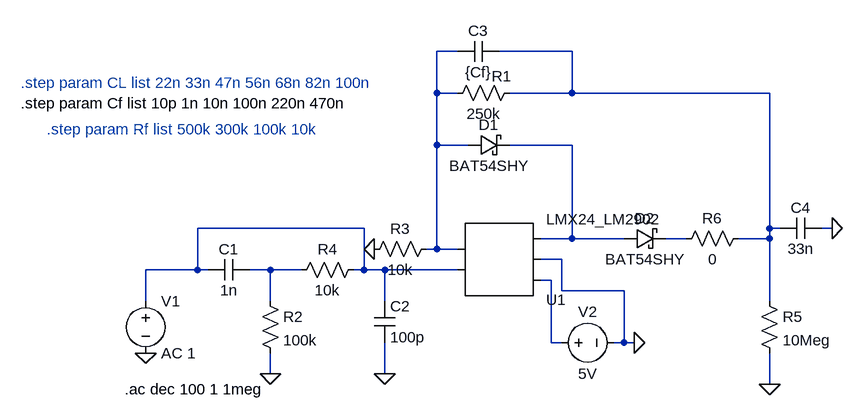
[diagram p0: schematic Opamp-AC2.asc]
Opamp-AC2.asc, the LTspice schematic file:
Version 4
SHEET 1 1220 680
WIRE 624 -256 592 -256
WIRE 800 -256 688 -256
WIRE 592 -192 592 -256
WIRE 624 -192 592 -192
WIRE 800 -192 800 -256
WIRE 800 -192 704 -192
WIRE 1104 -192 800 -192
WIRE 592 -112 592 -192
WIRE 640 -112 592 -112
WIRE 800 -112 704 -112
WIRE 480 16 224 16
WIRE 1104 16 1104 -192
WIRE 1120 16 1104 16
WIRE 1200 16 1184 16
WIRE 800 32 800 -112
WIRE 800 32 752 32
WIRE 880 32 800 32
WIRE 976 32 944 32
WIRE 1104 32 1104 16
WIRE 1104 32 1056 32
WIRE 592 48 592 -112
WIRE 592 48 576 48
WIRE 624 48 592 48
WIRE 784 64 752 64
WIRE 224 80 224 16
WIRE 224 80 144 80
WIRE 240 80 224 80
WIRE 336 80 304 80
WIRE 384 80 336 80
WIRE 480 80 480 16
WIRE 480 80 464 80
WIRE 512 80 480 80
WIRE 624 80 512 80
WIRE 768 96 752 96
WIRE 784 112 784 64
WIRE 880 112 784 112
WIRE 144 128 144 80
WIRE 336 128 336 80
WIRE 512 128 512 80
WIRE 1104 128 1104 32
WIRE 768 192 768 96
WIRE 784 192 768 192
WIRE 880 192 880 112
WIRE 880 192 864 192
WIRE 896 192 880 192
WIRE 336 240 336 208
WIRE 512 240 512 192
WIRE 1104 256 1104 208
FLAG 144 208 0
FLAG 336 240 0
FLAG 496 48 0
FLAG 512 240 0
FLAG 1104 256 0
FLAG 1200 16 0
FLAG 896 192 0
SYMBOL voltage 144 112 R0
WINDOW 123 0 0 Left 0
WINDOW 39 0 0 Left 0
SYMATTR InstName V1
SYMATTR Value AC 1
SYMBOL cap 304 64 R90
WINDOW 0 0 32 VBottom 2
WINDOW 3 32 32 VTop 2
SYMATTR InstName C1
SYMATTR Value 1n
SYMBOL res 320 112 R0
SYMATTR InstName R2
SYMATTR Value 100k
SYMBOL res 720 -208 R90
WINDOW 0 6 28 VBottom 2
WINDOW 3 32 56 VTop 2
SYMATTR InstName R1
SYMATTR Value 250k
SYMBOL res 592 32 R90
WINDOW 0 0 56 VBottom 2
WINDOW 3 32 56 VTop 2
SYMATTR InstName R3
SYMATTR Value 10k
SYMBOL schottky 640 -96 R270
WINDOW 0 32 32 VTop 2
WINDOW 3 0 32 VBottom 2
SYMATTR InstName D1
SYMATTR Value BAT54SHY
SYMATTR Description Diode
SYMATTR Type diode
SYMBOL schottky 880 48 R270
WINDOW 0 32 32 VTop 2
WINDOW 3 0 32 VBottom 2
SYMATTR InstName D2
SYMATTR Value BAT54SHY
SYMATTR Description Diode
SYMATTR Type diode
SYMBOL cap 688 -272 R90
WINDOW 0 0 32 VBottom 2
WINDOW 3 32 32 VTop 2
SYMATTR InstName C3
SYMATTR Value {Cf}
SYMBOL cap 496 128 R0
SYMATTR InstName C2
SYMATTR Value 100p
SYMBOL res 480 64 R90
WINDOW 0 0 56 VBottom 2
WINDOW 3 32 56 VTop 2
SYMATTR InstName R4
SYMATTR Value 10k
SYMBOL res 1088 112 R0
SYMATTR InstName R5
SYMATTR Value 10Meg
SYMBOL cap 1184 0 R90
WINDOW 0 0 32 VBottom 2
WINDOW 3 32 32 VTop 2
SYMATTR InstName C4
SYMATTR Value 33n
SYMBOL res 1072 16 R90
WINDOW 0 0 56 VBottom 2
WINDOW 3 32 56 VTop 2
SYMATTR InstName R6
SYMATTR Value 0
SYMBOL AutoGenerated\\LMX24_LM2902 688 64 M180
SYMATTR InstName U1
SYMBOL voltage 768 192 R270
WINDOW 0 32 56 VTop 2
WINDOW 3 -32 56 VBottom 2
WINDOW 123 0 0 Left 0
WINDOW 39 0 0 Left 0
SYMATTR InstName V2
SYMATTR Value 5V
TEXT 112 264 Left 2 !.ac dec 100 1 1meg
TEXT -48 -176 Left 2 !.step param Cf list 10p 1n 10n 100n 220n 470n
TEXT -8 -136 Left 2 ;.step param Rf list 500k 300k 100k 10k
TEXT -48 -208 Left 2 ;.step param CL list 22n 33n 47n 56n 68n 82n 100n

The netlist it stands for:
* Opamp-AC2.asc
V1 N004 0 AC 1
C1 N006 N004 1n
R2 N006 0 100k
R1 N002 N001 250k
R3 N001 0 10k
D1 N001 N003 BAT54SHY
D2 N003 N005 BAT54SHY
C3 N002 N001 {Cf}
C2 N004 0 100p
R4 N004 N006 10k
R5 N002 0 10Meg
C4 0 N002 33n
R6 N002 N005 0
* U1: LMX24_LM2902 (symbol AutoGenerated\LMX24_LM2902 not available, pins judged from their places): pin1=N004 pin2=N001 pin3=N007 pin4=0 pin5=N003
V2 N007 0 5V
.model D D
.lib standard.dio
.ac dec 100 1 1meg
.step param Cf list 10p 1n 10n 100n 220n 470n
* .step param Rf list 500k 300k 100k 10k
* .step param CL list 22n 33n 47n 56n 68n 82n 100n
.backanno
.end